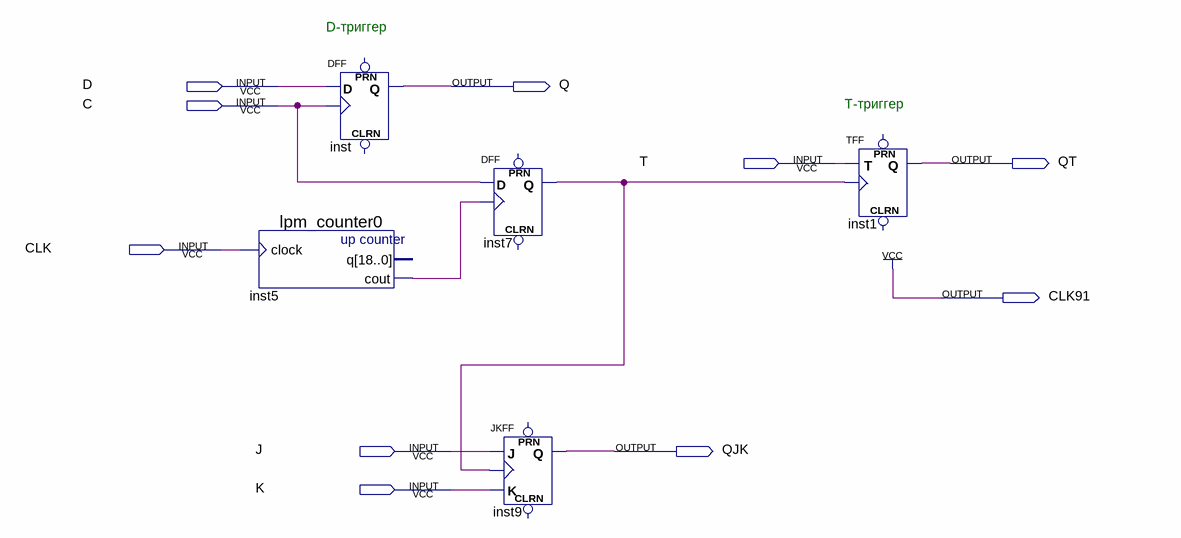
[diagram p0: schematic sheet]
// Quartus schematic project11_D_T_JK-triggers.bdf as structural Verilog: 5 symbols, 10 pins
module \project11_D_T_JK-triggers  (
  input  D,
  input  C,
  input  T,
  input  CLK,
  input  J,
  input  K,
  output Q,
  output QT,
  output CLK91,
  output QJK
);

  wire inst5_cout, inst7_q;

  lpm_counter0 inst5 (.clock(CLK), .cout(inst5_cout));  // open: q
  DFF inst (.CLK(C), .D(D), .Q(Q));  // open: CLRN, PRN
  DFF inst7 (.CLK(inst5_cout), .D(C), .Q(inst7_q));  // open: CLRN, PRN
  JKFF inst9 (.K(K), .J(J), .CLK(inst7_q), .Q(QJK));  // open: PRN, CLRN
  TFF inst1 (.T(T), .CLK(inst7_q), .Q(QT));  // open: PRN, CLRN

  assign CLK91 = 1'b1;

  // Notes on the sheet:
  //   D-триггер
  //   T-триггер
endmodule
